# EasyEDA Pro project ProProject_TC264主板_2024-10-06.epro

# Schematic Schematic1

## Sheets
1 CoreBoard
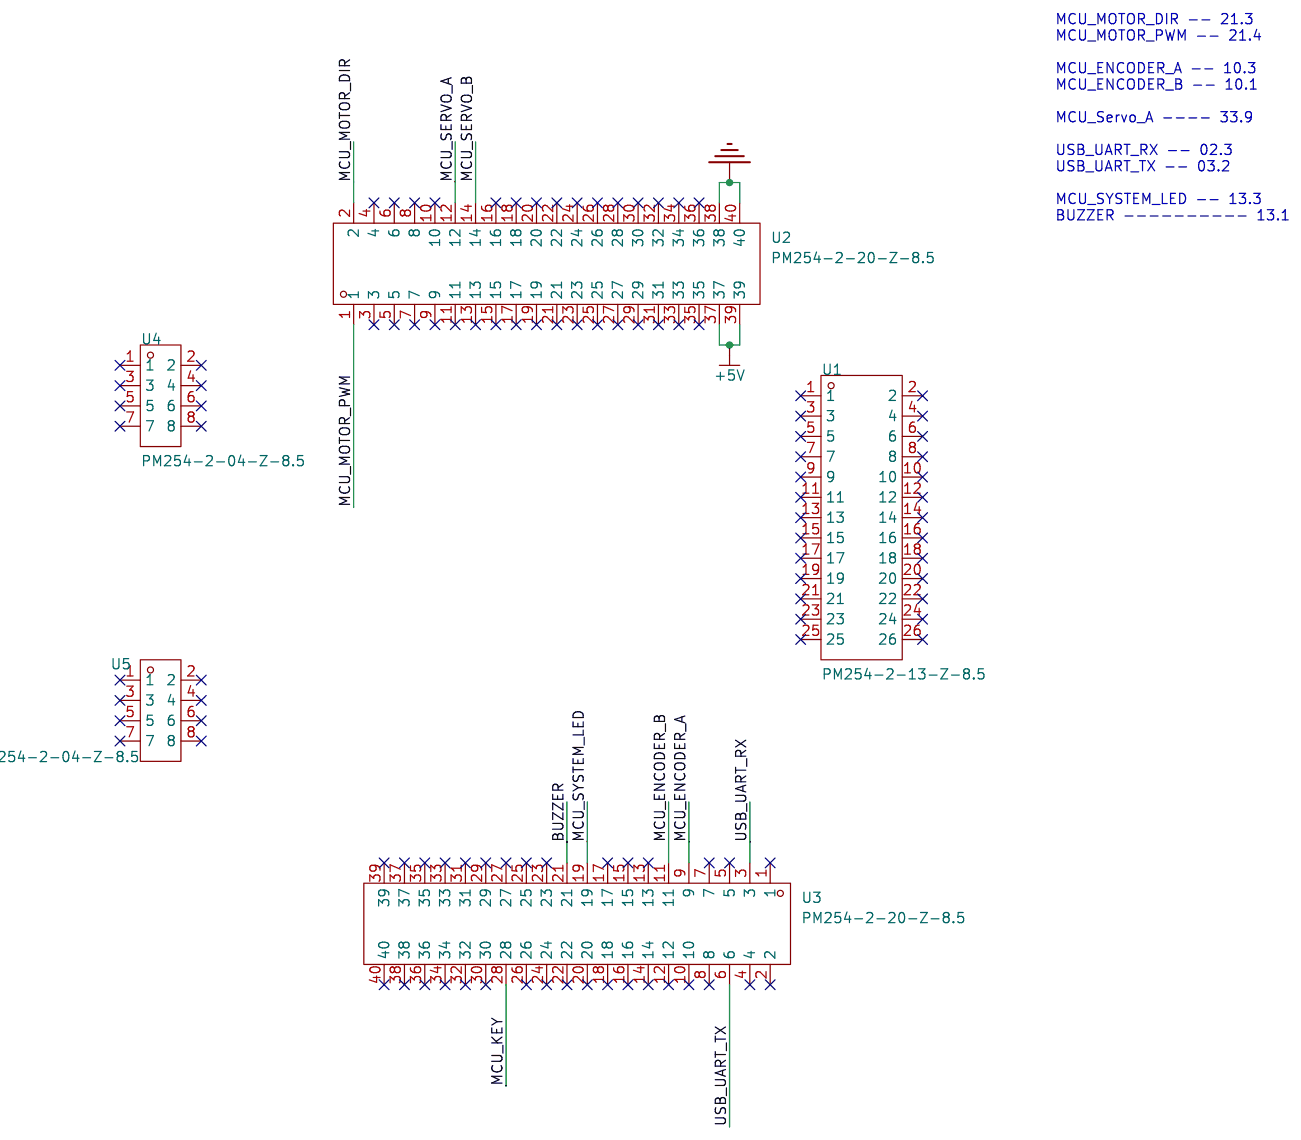
[diagram p0: CoreBoard]
2 Power: Create Date: 2024-03-05; Page Name: Power; Project Name: TC264主板; Schematic Name: Schematic1; Update Date: 2024-03-05; Company: 嘉立创EDA; Page Size: A4; Version: V1.0
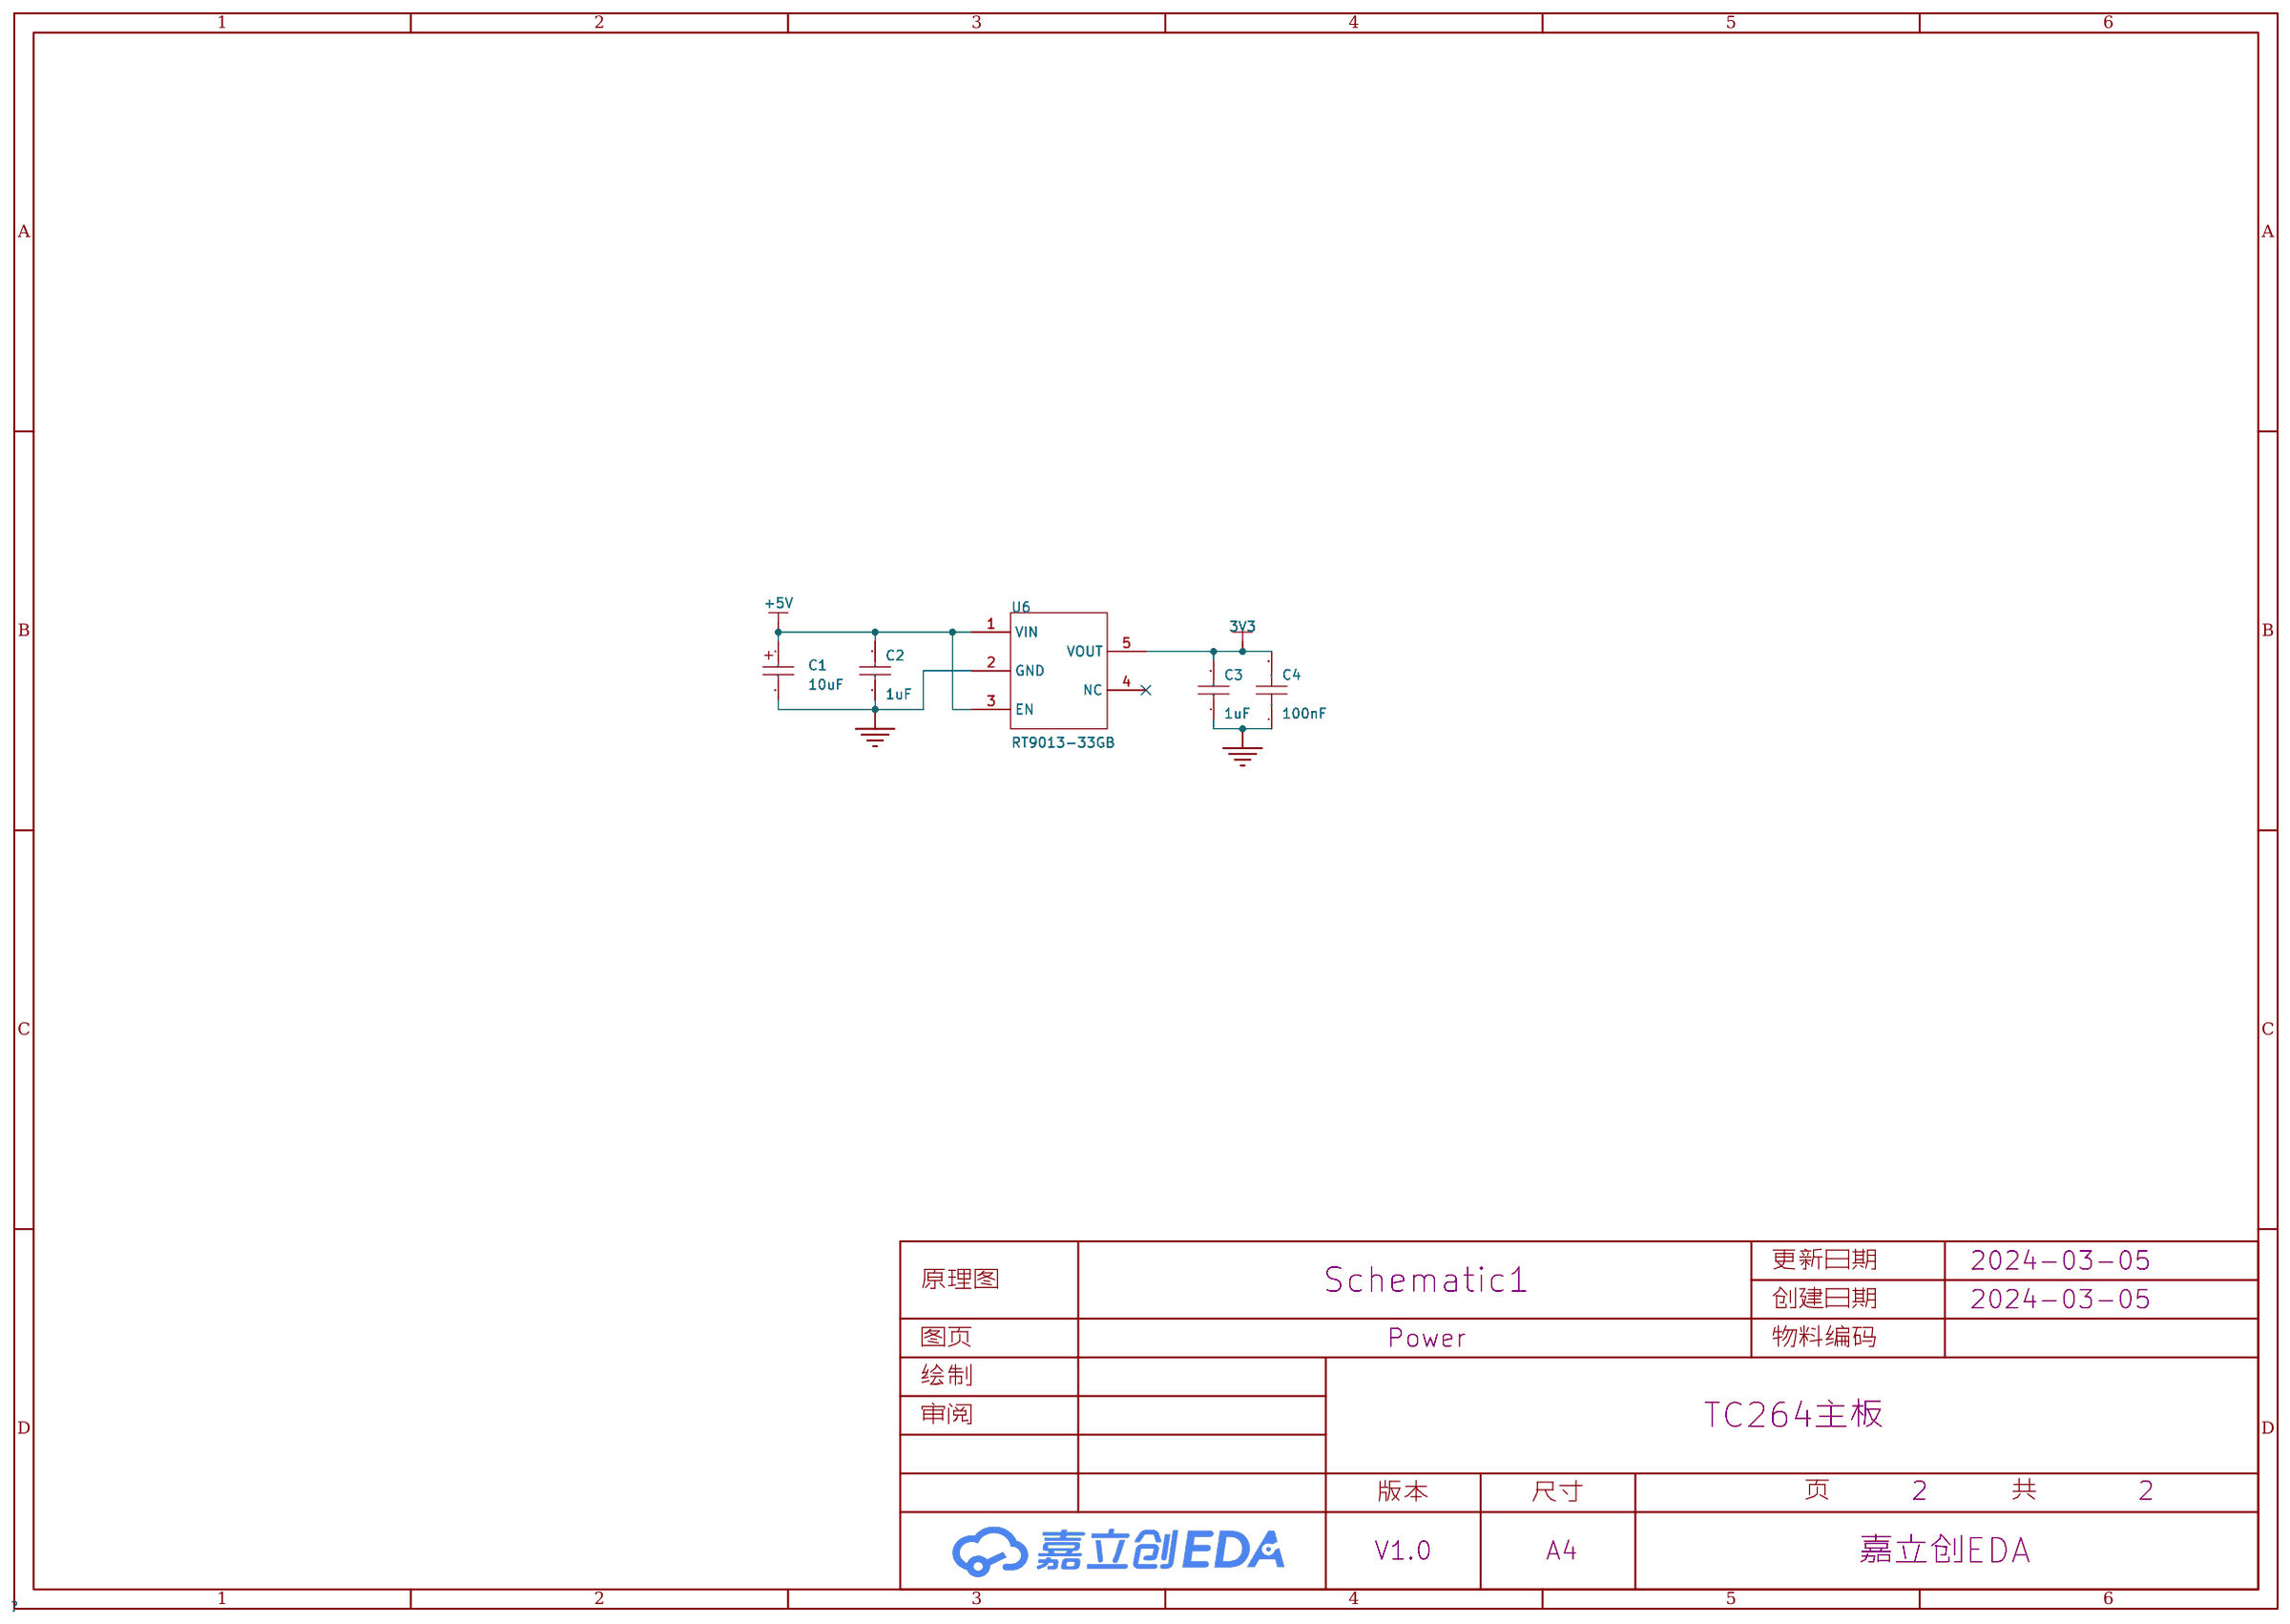
[diagram p1: Power]
3 HMI: Create Date: 2024-03-05; Page Name: HMI; Project Name: TC264主板; Schematic Name: Schematic1; Update Date: 2024-03-07; Company: 嘉立创EDA; Page Size: A4; Version: V1.0
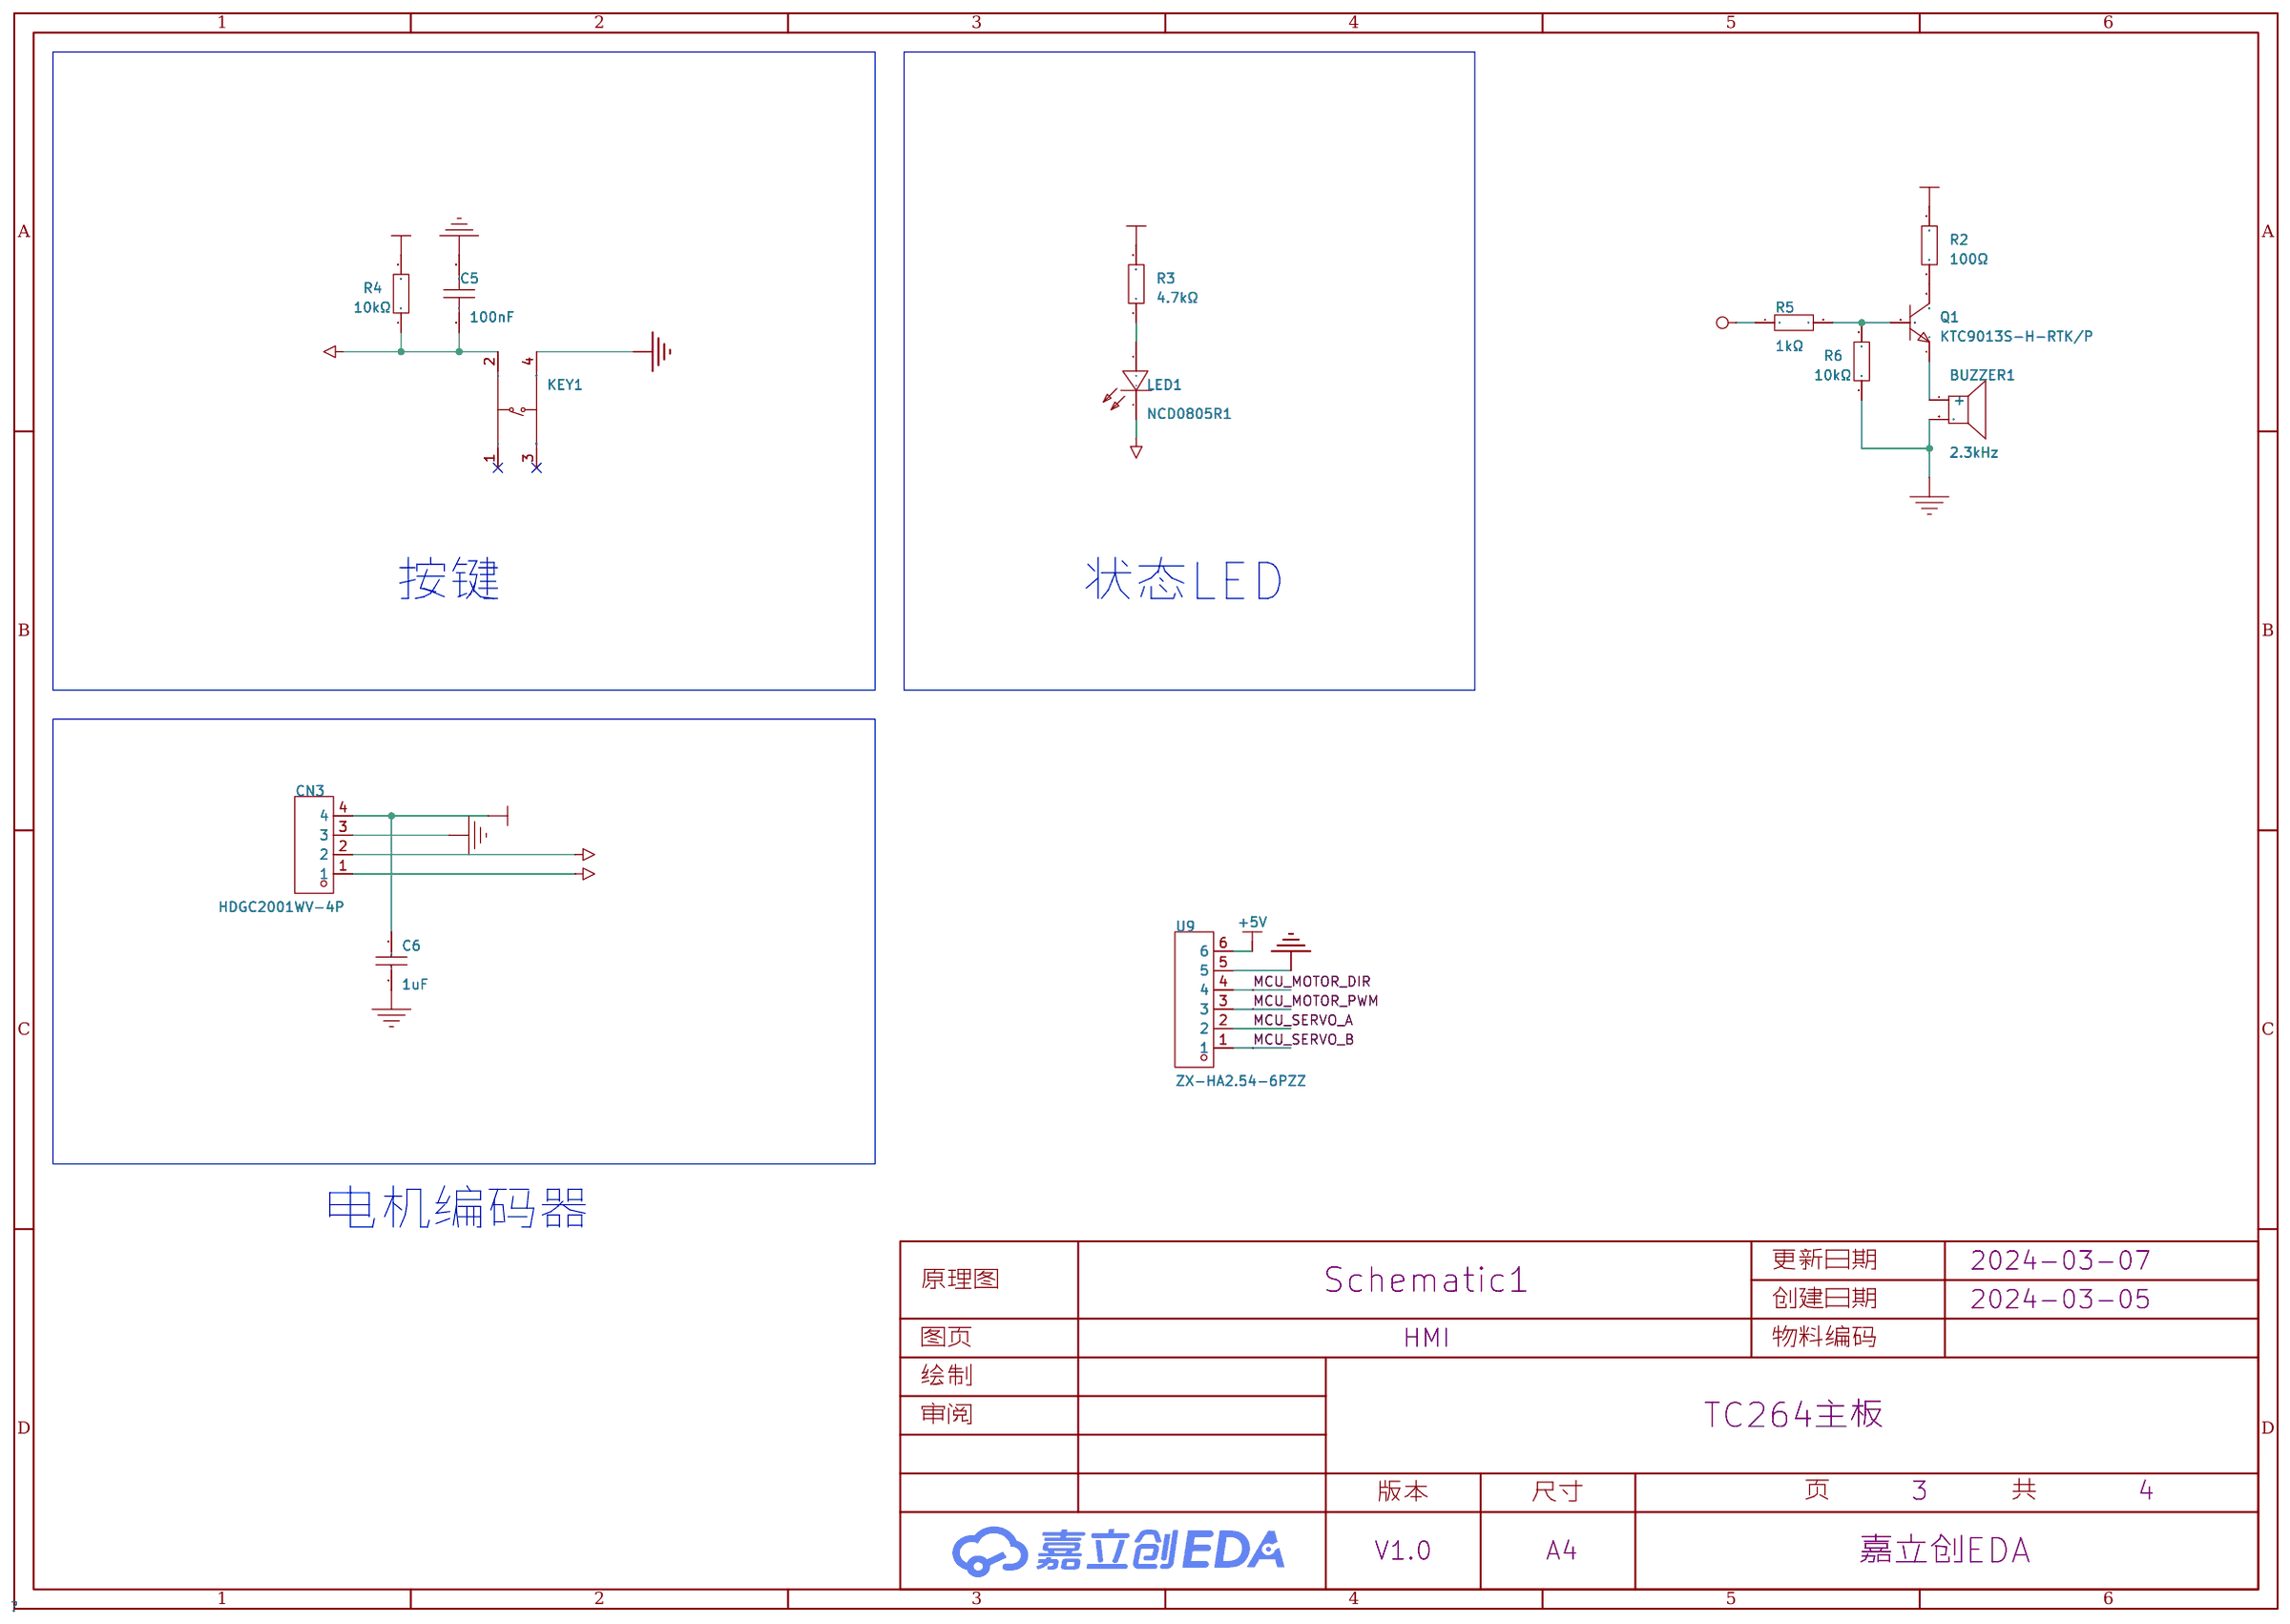
[diagram p2: HMI]
4 COM: Create Date: 2024-03-05; Page Name: COM; Project Name: TC264主板; Schematic Name: Schematic1; Update Date: 2024-05-22; Company: 嘉立创EDA; Page Size: A4; Version: V1.0
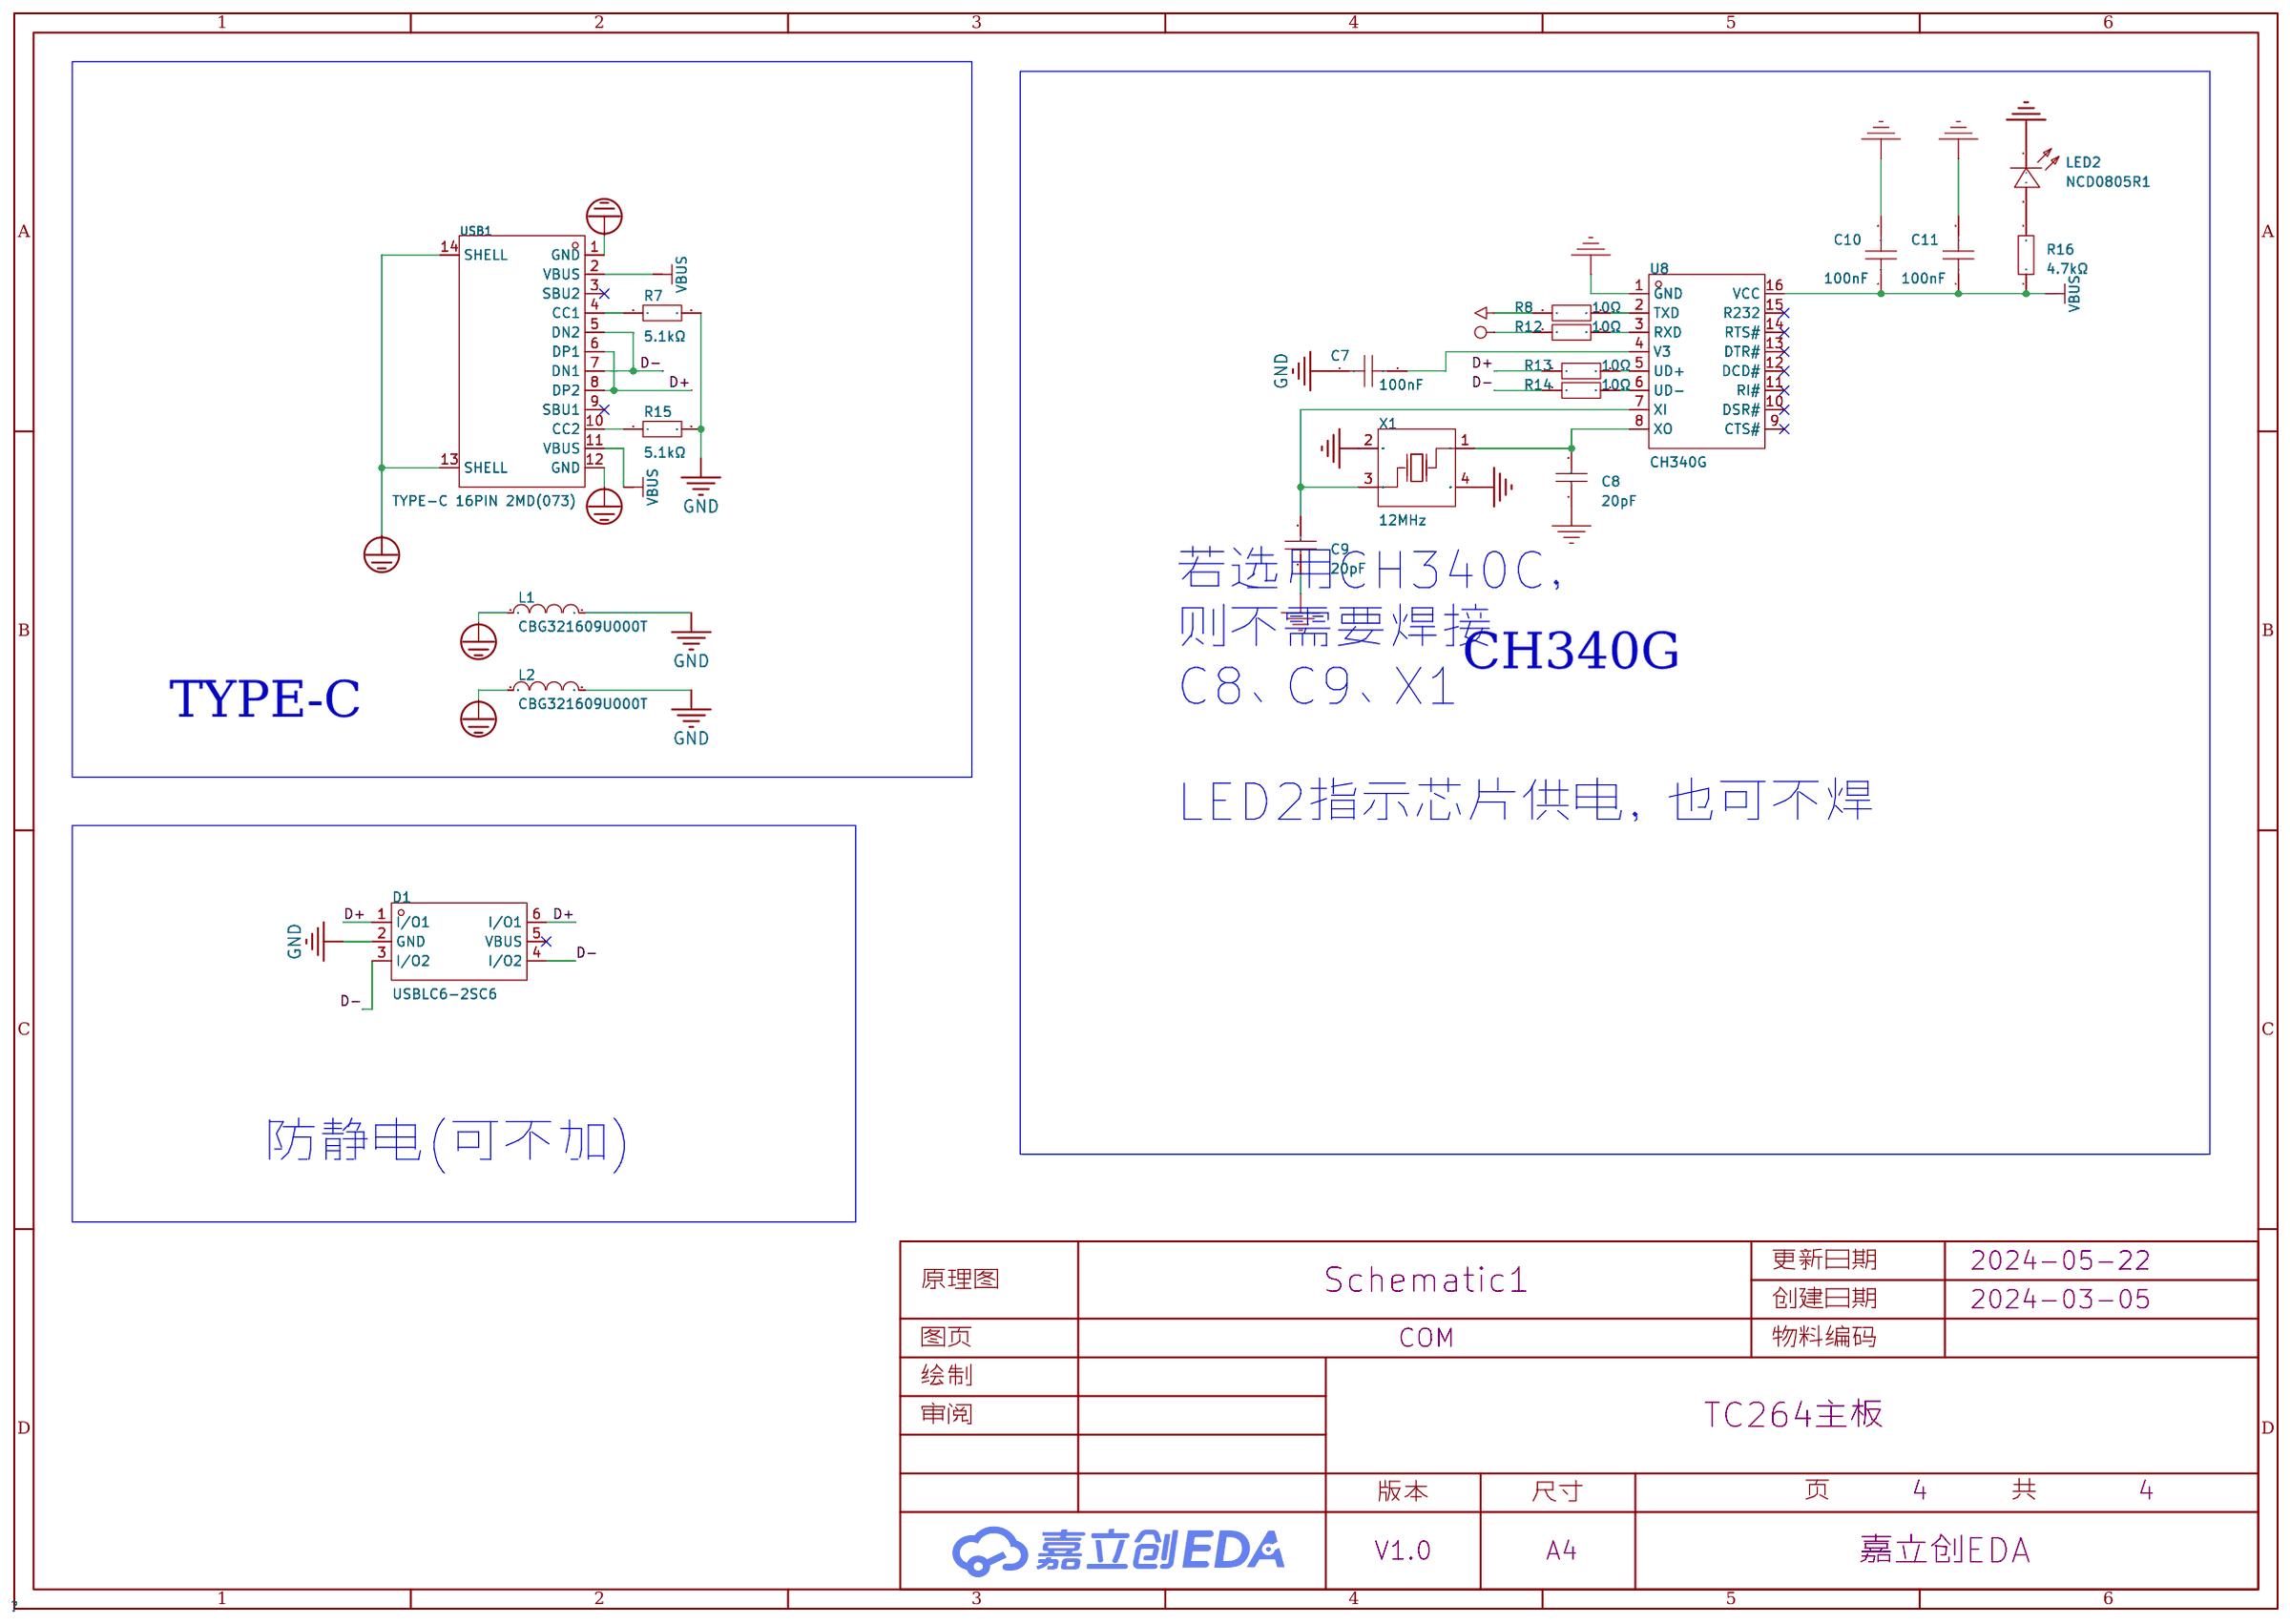
[diagram p3: COM]

## Parts
sheet COM
C7  100nF  [C0603]
C8  20pF  [C0603]
C9  20pF  [C0603]
C10  100nF  [C0603]
C11  100nF  [C0603]
D1  USBLC6-2SC6  [SOT-23-6_L2.9-W1.6-P0.95-LS2.8-BL]
L1  CBG321609U000T  [L1206]
L2  CBG321609U000T  [L1206]
LED2  NCD0805R1  [LED0805-RD]
R7  5.1kΩ  [R0603]
R8  10Ω  [R0603]
R12  10Ω  [R0603]
R13  10Ω  [R0603]
R14  10Ω  [R0603]
R15  5.1kΩ  [R0603]
R16  4.7kΩ  [R0805]
U8  CH340G  [SOIC-16_L9.9-W3.9-P1.27-LS6.0-BL]
USB1  TYPE-C 16PIN 2MD(073)  [USB-C-SMD_TYPE-C-6PIN-2MD-073]
X1  12MHz  [OSC-SMD_4P-L3.2-W2.5-BL]
sheet CoreBoard
U1  PM254-2-13-Z-8.5  [HDR-TH_26P-P2.54-V-F-R2-C13-S2.54-1]
U2  PM254-2-20-Z-8.5  [HDR-TH_40P-P2.54-V-F-R2-C20-S2.54]
U3  PM254-2-20-Z-8.5  [HDR-TH_40P-P2.54-V-F-R2-C20-S2.54]
U4  PM254-2-04-Z-8.5  [HDR-TH_8P-P2.54-V-F-R2-C4-S2.54]
U5  PM254-2-04-Z-8.5  [HDR-TH_8P-P2.54-V-F-R2-C4-S2.54]
sheet HMI
BUZZER1  2.3kHz  [BUZ-TH_BD12.0-P7.60-D0.6-FD]
C5  100nF  [C0603]
C6  1uF  [C0603]
CN3  HDGC2001WV-4P  [CONN-TH_4P-P2.00_HDGC_HDGC2001WV-4P]
KEY1  TS665CJ  [SW-TH_4P-L6.0-W6.0-P4.50-LS6.5]
LED1  NCD0805R1  [LED0805-RD]
Q1  KTC9013S-H-RTK/P  [SOT-23-3_L2.9-W1.3-P1.90-LS2.4-TR-CW]
R2  100Ω  [R0603]
R3  4.7kΩ  [R0805]
R4  10kΩ  [R0603]
R5  1kΩ  [R0603]
R6  10kΩ  [R0603]
U9  ZX-HA2.54-6PZZ  [CONN-TH_6P-P2.50_ZX-HA2.54-6PZZ]
sheet Power
C1  10uF  [CAP-SMD_L3.2-W1.6-RD-C7171]
C2  1uF  [C0603]
C3  1uF  [C0603]
C4  100nF  [C0603]
U6  RT9013-33GB  [SOT-23-5_L3.0-W1.7-P0.95-LS2.8-BL]

## Library data of the parts
C4 C5 C7 C10 C11 = CC0603KRX7R9BB104: 容值:100nF;精度:±10%;额定电压:50V;材质(温度系数):X7R;; LCSC Part Name: 100nF ±10% 50V; Supplier Part: C14663; Manufacturer: YAGEO(国巨); Supplier Footprint: 0603; JLCPCB Part Class: 基础库; Datasheet: https://atta.szlcsc.com/upload/public/pdf/source/20180910/C282072_33301C7F631E79921B82A8DAC6BCC5B3.pdf; Supplier: LCSC; Tolerance: ±10%; Voltage Rated: 50V; Temperature Coefficient: X7R
C8 C9 = CC0603JRNPO9BN200: 容值:20pF;精度:±5%;额定电压:50V;材质(温度系数):NP0;; LCSC Part Name: 20pF ±5% 50V; Supplier Part: C105621; Manufacturer: YAGEO(国巨); Supplier Footprint: 0603; JLCPCB Part Class: Extended Part; Datasheet: https://atta.szlcsc.com/upload/public/pdf/source/20170425/1493115771885.pdf; Supplier: LCSC; Tolerance: ±5%; Voltage Rated: 50V; Temperature Coefficient: NP0
D1 = USBLC6-2SC6: Supplier Part: C2687116; Manufacturer: UMW(广东友台半导体); Supplier Footprint: SOT-23-6; Datasheet: https://atta.szlcsc.com/upload/public/pdf/source/20220623/8F66CD7F92B22A875BD04E197BDA4F88.pdf; Supplier: LCSC
L1 L2 = CBG321609U000T: 标称阻抗@测试频率:0Ω@100MHz;直流电阻(RDC):100mΩ;; LCSC Part Name: 单路 1206磁珠 阻抗0Ω@100MHz; Supplier Part: C94305; Manufacturer: FH(风华); Supplier Footprint: 1206; JLCPCB Part Class: 扩展库; Datasheet: https://atta.szlcsc.com/upload/public/pdf/source/20170914/C94305_1505374147416969225.pdf; Supplier: LCSC; Impedance @ Frequency: 0Ω@100MHz; DC Resistance: 100mΩ; Current Rating: 1A; Circuits: 1
LED1 LED2 = NCD0805R1: 发光颜色:红灯;; LCSC Part Name: 红灯; Supplier Part: C84256; Manufacturer: 国星光电; Supplier Footprint: 0805; JLCPCB Part Class: Basic Part; Datasheet: https://atta.szlcsc.com/upload/public/pdf/source/20200820/C84256_F0A75A43B3EAD75808600A0514C76B99.pdf; Supplier: LCSC; Emitted Color: 红灯
R7 R15 = 0603WAF5101T5E: 电阻类型:厚膜电阻;阻值:5.1kΩ;精度:±1%;功率:100mW;温度系数:±100ppm/℃;最大工作电压:75V;工作温度范围:-55℃~+155℃;; LCSC Part Name: 5.1kΩ ±1% 100mW; Supplier Part: C23186; Manufacturer: UNI-ROYAL(厚声); Supplier Footprint: 0603; JLCPCB Part Class: 基础库; Datasheet: https://atta.szlcsc.com/upload/public/pdf/source/20200306/C422600_1E6D84923E4A46A82E41ADD87F860B5C.pdf; Supplier: LCSC; Type: 厚膜电阻; Tolerance: ±1%; Power(Watts): 100mW; Temperature Coefficient: ±100ppm/℃; Overload Voltage (Max): 75V; Operating Temperature Range: -55℃~+155℃
R8 R12-R14 = 0603WAF100JT5E: 电阻类型:厚膜电阻;阻值:10Ω;精度:±1%;功率:100mW;温度系数:±400ppm/℃;最大工作电压:75V;工作温度范围:-55℃~+155℃;; LCSC Part Name: 10Ω ±1% 100mW; Supplier Part: C22859; Manufacturer: UNI-ROYAL(厚声); Supplier Footprint: 0603; JLCPCB Part Class: 基础库; Datasheet: https://atta.szlcsc.com/upload/public/pdf/source/20200306/C422600_1E6D84923E4A46A82E41ADD87F860B5C.pdf; Supplier: LCSC; Type: 厚膜电阻; Tolerance: ±1%; Power(Watts): 100mW; Temperature Coefficient: ±400ppm/℃; Overload Voltage (Max): 75V; Operating Temperature Range: -55℃~+155℃
R3 R16 = RS-05K4701FT: 阻值:4.7kΩ;精度:±1%;功率:125mW;温度系数:±100ppm/℃;最大工作电压:150V;工作温度范围:-55℃~+155℃;; LCSC Part Name: 4.7kΩ ±1% 125mW; Supplier Part: C115319; Manufacturer: FH(风华); Supplier Footprint: 0805; JLCPCB Part Class: Extended Part; Datasheet: https://atta.szlcsc.com/upload/public/pdf/source/20170912/C115319_1505207841791963513.pdf; Supplier: LCSC; Tolerance: ±1%; Power(Watts): 125mW; Temperature Coefficient: ±100ppm/℃; Overload Voltage (Max): 150V; Operating Temperature Range: -55℃~+155℃
U8 = CH340G: 类型:Transceiver;协议类别:USB 2.0;驱动器/接收器数:-;数据速率:2Mbps;; Supplier Part: C14267; Manufacturer: WCH(南京沁恒); Supplier Footprint: SOP-16-150mil; JLCPCB Part Class: Extended Part; Datasheet: https://atta.szlcsc.com/upload/public/pdf/source/20200819/C14267_9F0B4B8160AEBA86F3219E64956E4601.pdf; Supplier: LCSC; Type: Transceiver; Protocol: USB 2.0; Data Rate: 2Mbps; Supply Voltage: 3.3V, 5V
USB1 = TYPE-C 16PIN 2MD(073): 连接器类型:Type-C;标准:-;公母:母座;触点数量:16;端口数量:1;安装方式:卧贴;额定电流 - 电源:5A;工作温度范围:-25℃~+85℃;; LCSC Part Name: TYPE-C母座 16P 4脚插件带定位柱 不锈钢外壳 2次模顶; Supplier Part: C2765186; Manufacturer: SHOU HAN(首韩); Supplier Footprint: SMD; Supplier: LCSC; Connector Type: Type-C; Gender: 母座; Number of Contacts: 16; Number of Ports: 1; Mounting Style: 卧贴; Current Rating - Power (Max): 5A; Operating Temperature Range: -25℃~+85℃
X1 = X322512MSB4SI: 晶振类型:贴片无源晶振;频率:12MHz;频率公差:±10ppm;频率稳定度:±30ppm;负载电容:20pF;工作温度:-40℃~+85℃;; LCSC Part Name: 12MHz ±10ppm 20pF; Supplier Part: C9002; Manufacturer: YXC(扬兴晶振); Supplier Footprint: SMD3225-4P; JLCPCB Part Class: Basic Part; Datasheet: https://atta.szlcsc.com/upload/public/pdf/source/20210329/C112971_1F611BDC486E193C1706F6D8EB5AA189.pdf; Supplier: LCSC; Crystal Type: 贴片无源晶振; Frequency Tolerance: ±10ppm; Frequency Stability: ±30ppm; Load Capacitance: 20pF; Operating Temperature: -40℃~+85℃
U1 = PM254-2-13-Z-8.5: 插孔结构:2x13P;间距:2.54mm;行距:2.54mm;圆孔/方孔:方孔;安装类型:直插;排数:双排;总孔位数:26P;额定电流:3A;额定电压:-;插孔方向:顶部;塑高:8.5mm;触头材质:铜合金;工作温度范围:-40℃~+105℃;焊接温度(最大值):260℃@5S;; LCSC Part Name: 2x13P 间距:2.54mm 直插; Supplier Part: C2897414; Manufacturer: HCTL(华灿天禄); Supplier Footprint: 插件,P=2.54mm; JLCPCB Part Class: 扩展库; Datasheet: https://atta.szlcsc.com/upload/public/pdf/source/20230609/3D36CA2C1BFC9FD1C3F709AD9DFEB9C2.pdf; Supplier: LCSC; Holes Structure: 2x13P; Pitch: 2.54mm; Row Spacing: 2.54mm; Circular Hole / Square Hole: 方孔; Mounting Type: 直插; Number of Rows: 双排; Number of Holes: 26P; Current Rating (Max): 3A; Holes Direction: 顶部; Insulation Height: 8.5mm; Contact Material: 铜合金; Operating Temperature Range: -40℃~+105℃; Soldering Temperature(Max): 260℃@5S
U2 U3 = PM254-2-20-Z-8.5: 插孔结构:2x20P;间距:2.54mm;行距:2.54mm;圆孔/方孔:方孔;安装类型:直插;排数:双排;总孔位数:40P;额定电流:3A;额定电压:-;插孔方向:顶部;塑高:8.5mm;触头材质:铜合金;工作温度范围:-40℃~+105℃;焊接温度(最大值):260℃@5S;; LCSC Part Name: 2x20P 间距:2.54mm 直插; Supplier Part: C2897421; Manufacturer: HCTL(华灿天禄); Supplier Footprint: 插件,P=2.54mm; JLCPCB Part Class: 扩展库; Datasheet: https://atta.szlcsc.com/upload/public/pdf/source/20230609/3D36CA2C1BFC9FD1C3F709AD9DFEB9C2.pdf; Supplier: LCSC; Holes Structure: 2x20P; Pitch: 2.54mm; Row Spacing: 2.54mm; Circular Hole / Square Hole: 方孔; Mounting Type: 直插; Number of Rows: 双排; Number of Holes: 40P; Current Rating (Max): 3A; Holes Direction: 顶部; Insulation Height: 8.5mm; Contact Material: 铜合金; Operating Temperature Range: -40℃~+105℃; Soldering Temperature(Max): 260℃@5S
U4 U5 = PM254-2-04-Z-8.5: 插孔结构:2x4P;间距:2.54mm;行距:2.54mm;圆孔/方孔:方孔;安装类型:直插;排数:双排;总孔位数:8P;额定电流:3A;额定电压:-;插孔方向:顶部;塑高:8.5mm;触头材质:铜合金;工作温度范围:-40℃~+105℃;焊接温度(最大值):260℃@5S;; LCSC Part Name: 2x4P 间距:2.54mm 直插; Supplier Part: C2897405; Manufacturer: HCTL(华灿天禄); Supplier Footprint: 插件,P=2.54mm; JLCPCB Part Class: 扩展库; Datasheet: https://atta.szlcsc.com/upload/public/pdf/source/20230609/3D36CA2C1BFC9FD1C3F709AD9DFEB9C2.pdf; Supplier: LCSC; Holes Structure: 2x4P; Pitch: 2.54mm; Row Spacing: 2.54mm; Circular Hole / Square Hole: 方孔; Mounting Type: 直插; Number of Rows: 双排; Number of Holes: 8P; Current Rating (Max): 3A; Holes Direction: 顶部; Insulation Height: 8.5mm; Contact Material: 铜合金; Operating Temperature Range: -40℃~+105℃; Soldering Temperature(Max): 260℃@5S
BUZZER1 = TMB12A05_C96093: 驱动方式:有源(内含驱动线路);构造类型:电磁式;额定电压:5V;频率:2.3kHz;声压(SPL):85dB@5V,10cm;; LCSC Part Name: TMB12A05; Supplier Part: C96093; Manufacturer: 华能; Manufacturer Part: TMB12A05; Supplier Footprint: 插件,D=12mm; JLCPCB Part Class: Extended Part; Datasheet: https://atta.szlcsc.com/upload/public/pdf/source/20170522/1495448324811.pdf; Supplier: LCSC; Oscillator Circuit: 有源(内含驱动线路); Technology Type: 电磁式; Rated Voltage: 5V; Operating Voltage: 4V~8V; Sound Pressure Level (SPL): 85dB@5V,10cm; Diameter (φD): 12mm; Height: 9.8mm
C6 = 0603B105K250NT: 容值:1uF;精度:±10%;额定电压:25V;材质(温度系数):X7R;; LCSC Part Name: 1uF ±10% 25V; Supplier Part: C59302; Manufacturer: FH(风华); Supplier Footprint: 0603; JLCPCB Part Class: Extended Part; Datasheet: https://atta.szlcsc.com/upload/public/pdf/source/20170923/C59302_1506149498957988854.pdf; Supplier: LCSC; Tolerance: ±10%; Voltage Rated: 25V; Temperature Coefficient: X7R
CN3 = HDGC2001WV-4P: LCSC Part Name: PH2.0直针 4P; Supplier Part: C5175232; Manufacturer: HDGC(华德共创); Supplier Footprint: 直插,P=2mm; JLCPCB Part Class: Extended Part; Datasheet: https://atta.szlcsc.com/upload/public/pdf/source/20220916/C6875813FFA1039A4B3E585D63AEFA0D.pdf; Supplier: LCSC
KEY1 = TS665CJ: 触点电流:50mA;额定电压(DC):12V;电路结构:单刀单掷;安装方式:直插;按钮形状:圆形按钮;带灯:-;开关长度:6mm;开关宽度:6mm;开关高度:5mm;; LCSC Part Name: 6*6*5插件立式直插6x6dip按键轻触开关; Supplier Part: C393938; Manufacturer: SHOU HAN(首韩); Supplier Footprint: 插件; JLCPCB Part Class: 扩展库; Datasheet: https://atta.szlcsc.com/upload/public/pdf/source/20190521/C393938_BDABEAC600B4C55E200A80AA129B70BC.pdf; Supplier: LCSC; Contact Current: 50mA; Voltage Rating (DC): 12V; Circuit: 单刀单掷; Mounting Style: 直插; Actuator Style: 圆形按钮; Switch Length: 6mm; Switch Width: 6mm; Switch Height: 5mm
Q1 = KTC9013S-H-RTK/P: 晶体管类型:NPN;集射极击穿电压(Vceo):30V;集电极电流(Ic):500mA;功率(Pd):350mW;集电极截止电流(Icbo):100nA;集电极-发射极饱和电压(VCE(sat)@Ic,Ib):100mV@100mA,10mA;直流电流增益(hFE@Ic,Vce):96@50mA,1V;特征频率(fT):140MHz;工作温度:+150℃@(Tj);; LCSC Part Name: NPN 30V 500mA; Supplier Part: C125310; Manufacturer: KEC; Supplier Footprint: SOT-23; JLCPCB Part Class: Extended Part; Datasheet: https://atta.szlcsc.com/upload/public/pdf/source/20171201/C125310_15121174280461155976.pdf; Supplier: LCSC; Transistor Type: NPN; Collector-Emitter Breakdown Voltage (Vceo): 30V; Collector Current (Ic): 500mA; Power Dissipation (Pd): 350mW; Collector Cut-Off Current (Icbo): 100nA; Collector-Emitter Saturation Voltage (VCE(sat)@Ic,Ib): 100mV@100mA,10mA; DC Current Gain (hFE@Ic,Vce): 96@50mA,1V; Transition Frequency (fT): 140MHz; Operating Temperature: +150℃@(Tj)
R2 = 0603WAF1000T5E: 电阻类型:厚膜电阻;阻值:100Ω;精度:±1%;功率:100mW;温度系数:±200ppm/℃;最大工作电压:75V;工作温度范围:-55℃~+155℃;; LCSC Part Name: 100Ω ±1% 100mW; Supplier Part: C22775; Manufacturer: UNI-ROYAL(厚声); Supplier Footprint: 0603; JLCPCB Part Class: Basic Part; Datasheet: https://atta.szlcsc.com/upload/public/pdf/source/20200306/C422600_1E6D84923E4A46A82E41ADD87F860B5C.pdf; Supplier: LCSC; Type: 厚膜电阻; Tolerance: ±1%; Power(Watts): 100mW; Temperature Coefficient: ±200ppm/℃; Overload Voltage (Max): 75V; Operating Temperature Range: -55℃~+155℃
R4 R6 = 0603WAF1002T5E: 电阻类型:厚膜电阻;阻值:10kΩ;精度:±1%;功率:100mW;温度系数:±100ppm/℃;最大工作电压:75V;工作温度范围:-55℃~+155℃;; LCSC Part Name: 10kΩ ±1% 100mW; Supplier Part: C25804; Manufacturer: UNI-ROYAL(厚声); Supplier Footprint: 0603; JLCPCB Part Class: Basic Part; Datasheet: https://atta.szlcsc.com/upload/public/pdf/source/20200306/C422600_1E6D84923E4A46A82E41ADD87F860B5C.pdf; Supplier: LCSC; Type: 厚膜电阻; Tolerance: ±1%; Power(Watts): 100mW; Temperature Coefficient: ±100ppm/℃; Overload Voltage (Max): 75V; Operating Temperature Range: -55℃~+155℃
R5 = 0603WAF1001T5E: 电阻类型:厚膜电阻;阻值:1kΩ;精度:±1%;功率:100mW;温度系数:±100ppm/℃;最大工作电压:75V;工作温度范围:-55℃~+155℃;; LCSC Part Name: 1kΩ ±1% 100mW; Supplier Part: C21190; Manufacturer: UNI-ROYAL(厚声); Supplier Footprint: 0603; JLCPCB Part Class: Basic Part; Datasheet: https://atta.szlcsc.com/upload/public/pdf/source/20200306/C422600_1E6D84923E4A46A82E41ADD87F860B5C.pdf; Supplier: LCSC; Type: 厚膜电阻; Tolerance: ±1%; Power(Watts): 100mW; Temperature Coefficient: ±100ppm/℃; Overload Voltage (Max): 75V; Operating Temperature Range: -55℃~+155℃
U9 = ZX-HA2.54-6PZZ: 插针结构:1x6P;间距:2.54mm;安装方式:直插;参考系列:XH;总PIN数:6P;排数:1;每排PIN数:6;行距:-;额定电流:3A;触头材质:黄铜;触头镀层:锡;工作温度范围:-25℃~+85℃;; LCSC Part Name: 1x6P 间距:2.54mm 直插 系列:XH/HA带扣; Supplier Part: C7429618; Manufacturer: Megastar(兆星); Supplier Footprint: 插件,P=2.54mm; JLCPCB Part Class: 扩展库; Datasheet: https://atta.szlcsc.com/upload/public/pdf/source/20230619/9741958357BE16A00186B372434A49B2.pdf; Supplier: LCSC; Pins Structure: 1x6P; Pitch: 2.54mm; Mounting Style: 直插; Reference Series: XH; Number of Pins: 6P; Number of Rows: 1; Number of PINs Per Row: 6; Current Rating (Max): 3A; Contact Material: 黄铜; Contact Plating: 锡; Operating Temperature Range: -25℃~+85℃
C1 = TAJA106K016RNJ: 容值:10uF;精度:±10%;额定电压:16V;等效串联电阻:3Ω@100kHz;; LCSC Part Name: 10uF ±10% 16V; Supplier Part: C7171; Manufacturer: Kyocera AVX; Supplier Footprint: CASE-A-3216; JLCPCB Part Class: 基础库; Datasheet: https://atta.szlcsc.com/upload/public/pdf/source/20160107/1457707750344.pdf; Supplier: LCSC; Tolerance: ±10%; Rated Voltage: 16V; Equivalent Series Resistance(ESR): 3Ω@100kHz; Operating Temperature: -55℃~+125℃
C2 C3 = 0603B105K250NT: 容值:1uF;精度:±10%;额定电压:25V;材质(温度系数):X7R;; LCSC Part Name: 1uF ±10% 25V; Supplier Part: C59302; Manufacturer: FH(风华); Supplier Footprint: 0603; JLCPCB Part Class: 扩展库; Datasheet: https://atta.szlcsc.com/upload/public/pdf/source/20200305/C486355_26A10D38EF8C2A5C37091D0039909270.pdf; Supplier: LCSC; Tolerance: ±10%; Voltage Rated: 25V; Temperature Coefficient: X7R
U6 = RT9013-33GB: 输出类型:固定;最大输入电压:5.5V;输出电压:3.3V;最大输出电流:500mA;电源纹波抑制比(PSRR):50dB@(10kHz);输出极性:正极;; LCSC Part Name: 输入5.5V 输出3.3V 500mA; Supplier Part: C47773; Manufacturer: RICHTEK(立锜); Supplier Footprint: SOT-23-5; JLCPCB Part Class: 扩展库; Datasheet: https://atta.szlcsc.com/upload/public/pdf/source/20150504/1457707282459.pdf; Supplier: LCSC; Output Type: 固定; Maximum Input Voltage: 5.5V; Output Voltage: 3.3V; MAX Output Current: 500mA; Power Supply Rejection Ratio (PSRR): 50dB@(10kHz); Dropout Voltage: 400mV@(500mA); standby current: 50uA; Operating Temperature: -40℃~+85℃; Output Polarity: 正极; Number of Outputs: 1

## Nets
3V3: C3.2 C4.2 R3.2 R4.2 U6.5(VOUT)
+5V: C1.1 C2.2 C6.2 CN3.4 R2.2 U2.37 U2.39 U6.1(VIN) U6.3(EN) U9.6
GND: BUZZER1.2 C1.2 C2.1 C3.1 C4.1 C5.2 C6.1 C7.1 C8.1 C9.1 C10.2 C11.2 CN3.3 D1.2(GND) KEY1.4(D) L1.2 L2.2 LED2.1(-) R6.1 R7.2 R15.2 U2.38 U2.40 U6.2(GND) U8.1(GND) U9.5 X1.2(GND) X1.4(GND)
PGND: L1.1 L2.1 USB1.1(GND) USB1.12(GND) USB1.13(SHELL) USB1.14(SHELL)
VBUS: C10.1 C11.1 R16.1 U8.16(VCC) USB1.2(VBUS) USB1.11(VBUS)
BUZZER: R5.1 U3.21
D+: D1.1(I/O1) D1.6(I/O1) R13.1 USB1.6(DP1) USB1.8(DP2)
D-: D1.3(I/O2) D1.4(I/O2) R14.1 USB1.5(DN2) USB1.7(DN1)
MCU_ENCODER_A: CN3.2 U3.9
MCU_ENCODER_B: CN3.1 U3.11
MCU_KEY: C5.1 KEY1.2(B) R4.1 U3.28
MCU_MOTOR_DIR: U2.2 U9.4
MCU_MOTOR_PWM: U2.1 U9.3
MCU_SERVO_A: U2.12 U9.2
MCU_SERVO_B: U2.14 U9.1
MCU_SYSTEM_LED: LED1.1(-) U3.19
USB_UART_RX: R8.1 U3.3
USB_UART_TX: R12.1 U3.6
$3N545: Q1.2(B) R5.2 R6.2
$3N546: BUZZER1.1(+) Q1.1(E)
$3N549: Q1.3(C) R2.1
$3N998: LED1.2(+) R3.1
$4N891: C8.2 U8.8(XO) X1.1(OSC1)
$4N894: R8.2 U8.2(TXD)
$4N895: R12.2 U8.3(RXD)
$4N896: R13.2 U8.5(UD+)
$4N897: R14.2 U8.6(UD-)
$4N898: C9.2 U8.7(XI) X1.3(OSC2)
$4N903: C7.2 U8.4(V3)
$4N910: R7.1 USB1.4(CC1)
$4N911: R15.1 USB1.10(CC2)
$4N1948: LED2.2(+) R16.2

Not connected (* = marked no-connect by the designer): D1 5(VBUS)*; KEY1 1(A)* 3(C)*; U1 1* 2* 3* 4* 5* 6* 7* 8* 9* 10* 11* 12* 13* 14* 15* 16* 17* 18* 19* 20* 21* 22* 23* 24* 25* 26*; U2 3* 4* 5* 6* 7* 8* 9* 10* 11* 13* 15* 16* 17* 18* 19* 20* 21* 22* 23* 24* 25* 26* 27* 28* 29* 30* 31* 32* 33* 34* 35* 36*; U3 1* 2* 4* 5* 7* 8* 10* 12* 13* 14* 15* 16* 17* 18* 20* 22* 23* 24* 25* 26* 27* 29* 30* 31* 32* 33* 34* 35* 36* 37* 38* 39* 40*; U4 1* 2* 3* 4* 5* 6* 7* 8*; U5 1* 2* 3* 4* 5* 6* 7* 8*; U6 4(NC)*; U8 9(CTS#)* 10(DSR#)* 11(RI#)* 12(DCD#)* 13(DTR#)* 14(RTS#)* 15(R232)*; USB1 3(SBU2)* 9(SBU1)*

## Notes on the sheets
sheet 1
- MCU_MOTOR_DIR -- 21.3
  MCU_MOTOR_PWM -- 21.4
  MCU_ENCODER_A -- 10.3
  MCU_ENCODER_B -- 10.1
  MCU_Servo_A ---- 33.9
  USB_UART_RX -- 02.3
  USB_UART_TX -- 03.2
  MCU_SYSTEM_LED -- 13.3
  BUZZER ---------- 13.1
sheet 3
- 按键
- 状态LED
- 电机编码器
sheet 4
- CH340G
- TYPE-C
- 若选用CH340C，
  则不需要焊接
  C8、C9、X1
  LED2指示芯片供电，也可不焊
- 防静电(可不加)

# Board PCB1
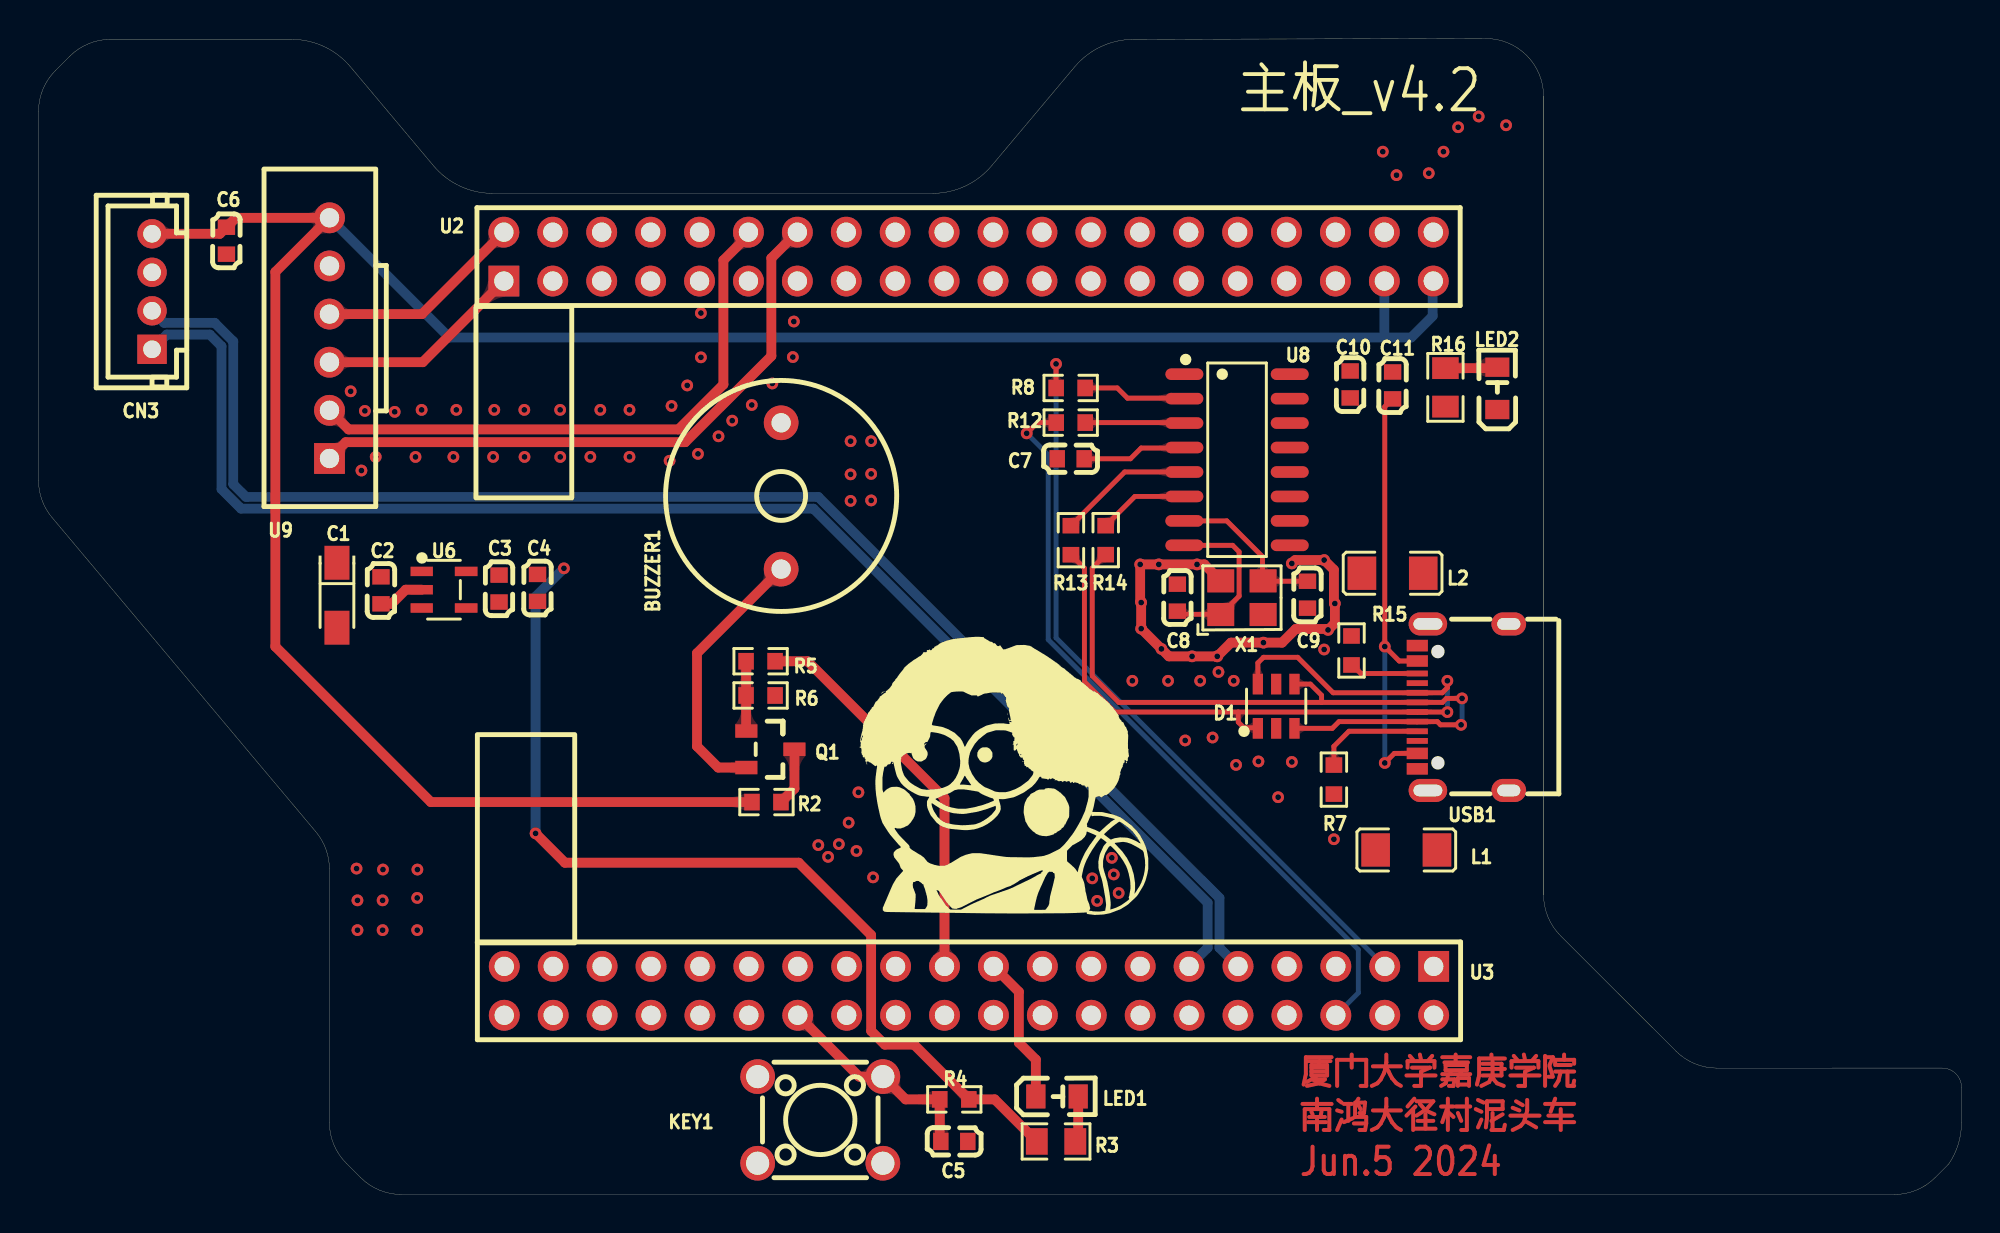
[diagram p4: board, top side]
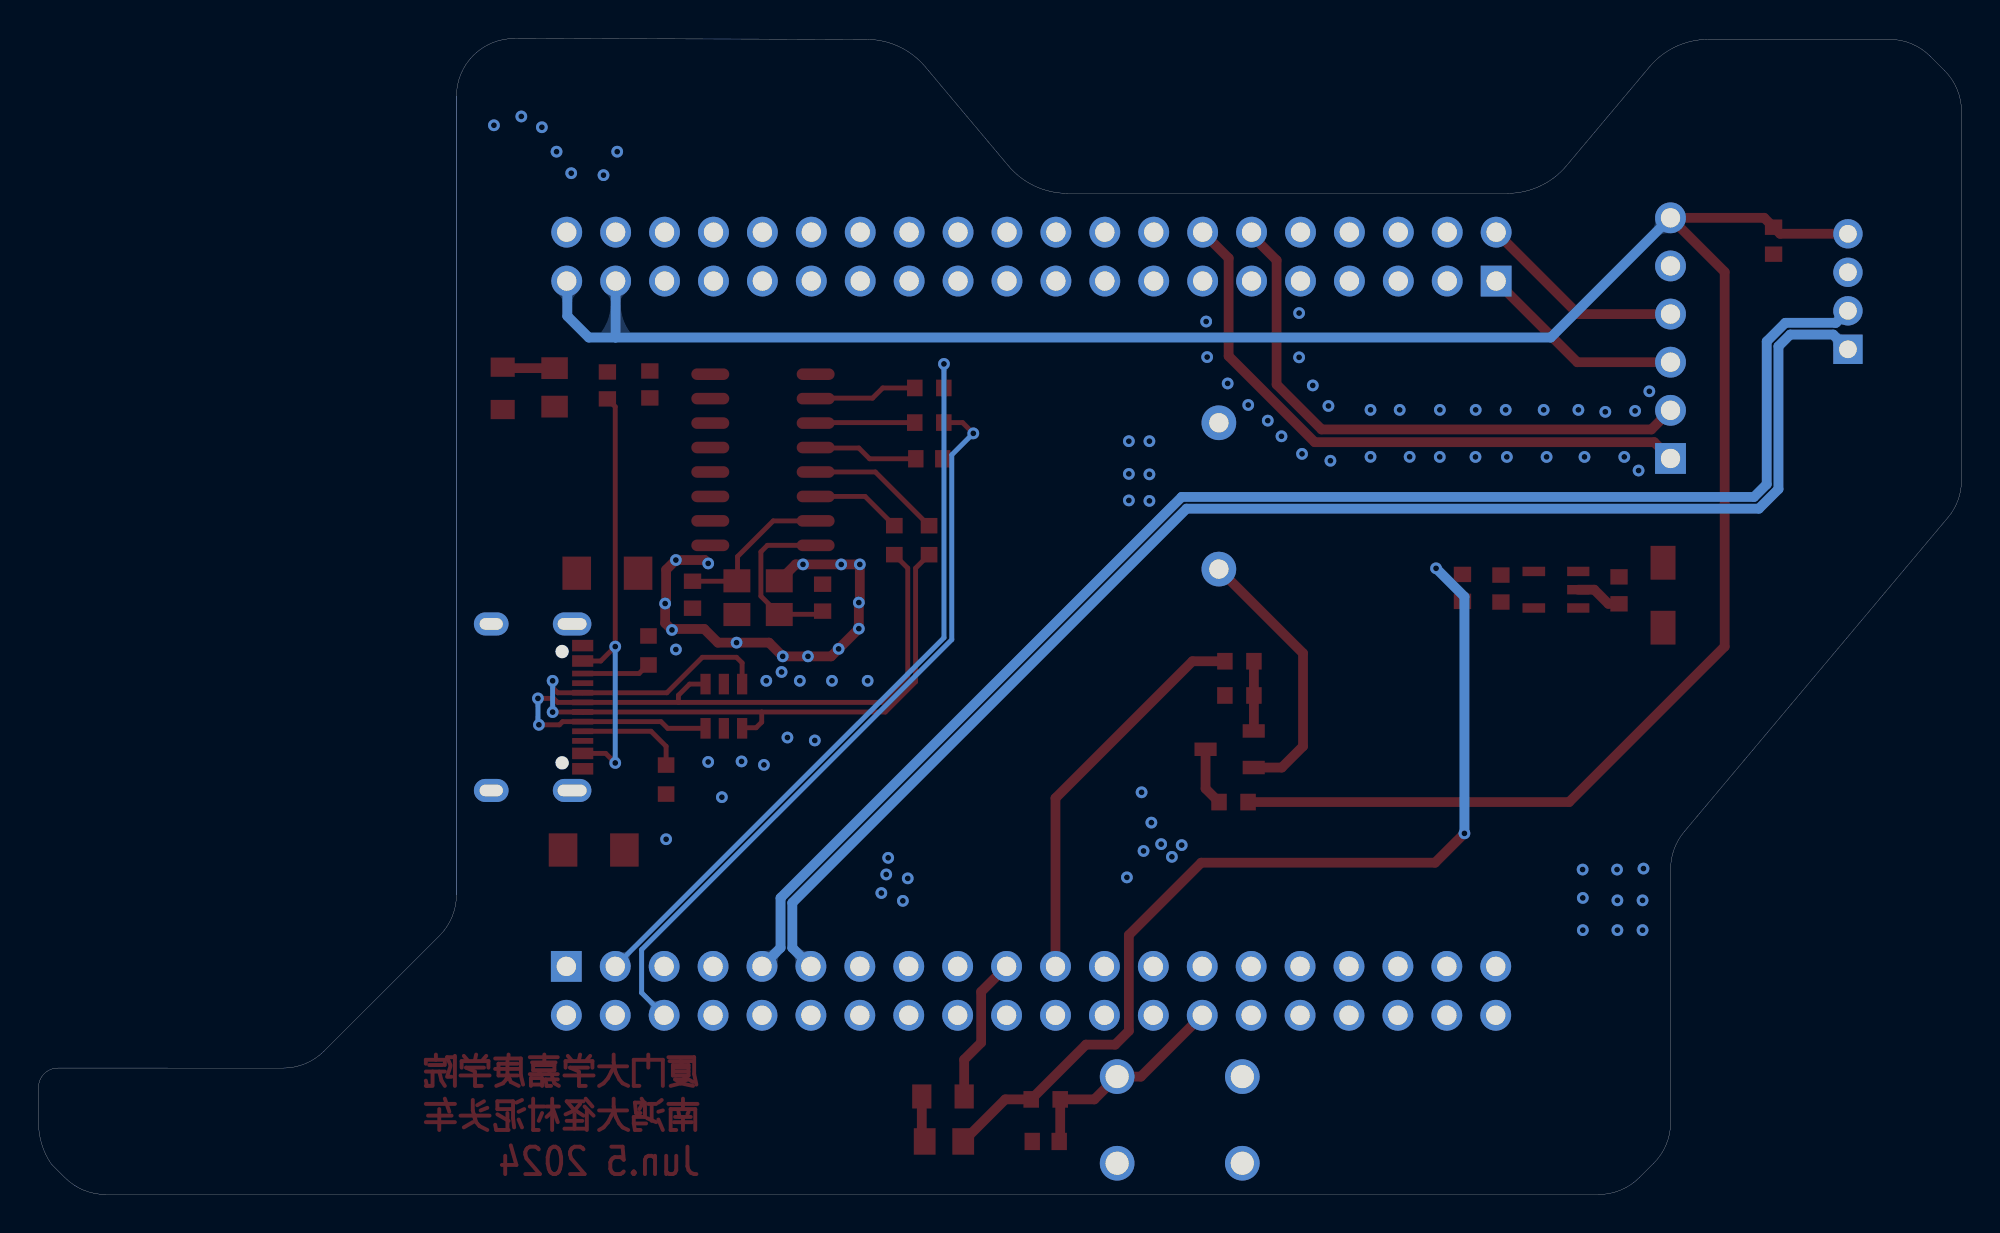
[diagram p5: board, bottom side, seen from below]

Outline 99.85 x 60.04 mm; copper layers: Top Layer, Bottom Layer. Coordinates in mm from the lower left corner of the outline.
Outline path: 78.15,57.04 arc(77.27,59.17) 75.14,60.04 56.87,60 arc(55.17,59.63) 53.8,58.57 49.49,53.43 arc(48.11,52.37) 46.42,52 23.58,52 arc(21.89,52.37) 20.51,53.43 16.2,58.57 arc(14.83,59.63) 13.14,60 3.74,60 arc(2.59,59.77) 1.62,59.12 0.88,58.38 arc(0.23,57.41) 0,56.26 0,37.09 arc(0.18,36.07) 0.7,35.16 14.4,18.84 arc(14.92,17.93) 15.1,16.91 15.1,3.74 arc(15.33,2.59) 15.98,1.62 16.73,0.88 arc(17.7,0.23) 18.85,0 96.36,0 arc(97.51,0.23) 98.48,0.88 99.19,1.58 arc(99.68,2.61) 99.85,3.74 99.85,5.57 arc(99.56,6.27) 98.85,6.57 87.15,6.57 arc(86,6.79) 85.03,7.44 79.03,13.44 arc(78.38,14.42) 78.15,15.56 ; 78.15,57.04 78.15,15.56 ; 78.15,57.04 78.15,15.56
Stack: Top Layer 0.035mm / Dielectric1 1.51mm FR4 er 4.5 / Bottom Layer 0.035mm

## Design rules (mm)
template: 自定义配置
spacing copperThickness1oz (default): track to track 0.102, other pairs 0.127 to 0.3
spacing copperThickness2oz: track to track 0.203, other pairs 0.152 to 0.3
track width copperThickness1oz (default): min 0.127, default 0.254, max 2.54
track width copperThickness2oz: min 0.203, default 0.254, max 2.54
differential pair differentialPair (default): width min 0.127, default 0.254, max 2.54; gap min 0.152, default 0.152
via viaSize (default): diameter min 0.5, default 0.61, max 10; hole min 0.3, default 0.305, max 6.299

## Placement (name value [footprint] x y rotation side)
BUZZER1  2.3kHz  [BUZ-TH_BD12.0-P7.60-D0.6-FD]  38.56 36.28 90 top
C1  10uF  [CAP-SMD_L3.2-W1.6-RD-C7171]  15.5 31.13 270 top
C2  1uF  [C0603]  17.78 31.38 90 top
C3  1uF  [C0603]  23.91 31.47 90 top
C4  100nF  [C0603]  25.91 31.51 90 top
C5  100nF  [C0603]  47.55 2.76 0 top
C6  1uF  [C0603]  9.76 49.54 90 top
C7  100nF  [C0603]  53.6 38.21 0 top
C8  20pF  [C0603]  59.13 31 270 top
C9  20pF  [C0603]  65.89 31.15 90 top
C10  100nF  [C0603]  68.11 42.07 90 top
C11  100nF  [C0603]  70.31 42.02 90 top
CN3  HDGC2001WV-4P  [CONN-TH_4P-P2.00_HDGC_HDGC2001WV-4P]  5.9 46.9 90 top
D1  USBLC6-2SC6  [SOT-23-6_L2.9-W1.6-P0.95-LS2.8-BL]  64.27 25.36 0 top
KEY1  TS665CJ  [SW-TH_4P-L6.0-W6.0-P4.50-LS6.5]  40.59 3.87 0 top
L1  CBG321609U000T  [L1206]  71.02 17.89 180 top
L2  CBG321609U000T  [L1206]  70.31 32.27 180 top
LED1  NCD0805R1  [LED0805-RD]  52.89 5.09 0 top
LED2  NCD0805R1  [LED0805-RD]  75.75 41.87 90 top
Q1  KTC9013S-H-RTK/P  [SOT-23-3_L2.9-W1.3-P1.90-LS2.4-TR-CW]  38 23.13 180 top
R2  100Ω  [R0603]  37.8 20.38 180 top
R3  4.7kΩ  [R0805]  52.83 2.76 180 top
R4  10kΩ  [R0603]  47.55 4.94 0 top
R5  1kΩ  [R0603]  37.49 27.7 180 top
R6  10kΩ  [R0603]  37.49 25.92 180 top
R7  5.1kΩ  [R0603]  67.26 21.55 270 top
R8  10Ω  [R0603]  53.6 41.89 0 top
R12  10Ω  [R0603]  53.6 40.09 0 top
R13  10Ω  [R0603]  53.61 33.98 90 top
R14  10Ω  [R0603]  55.41 33.99 90 top
R15  5.1kΩ  [R0603]  68.18 28.26 90 top
R16  4.7kΩ  [R0805]  73.05 41.92 90 top
U2  PM254-2-20-Z-8.5  [HDR-TH_40P-P2.54-V-F-R2-C20-S2.54]  48.29 48.71 0 top
U3  PM254-2-20-Z-8.5  [HDR-TH_40P-P2.54-V-F-R2-C20-S2.54]  48.31 10.58 180 top
U6  RT9013-33GB  [SOT-23-5_L3.0-W1.7-P0.95-LS2.8-BL]  21.05 31.41 270 top
U8  CH340G  [SOIC-16_L9.9-W3.9-P1.27-LS6.0-BL]  62.23 38.16 270 top
U9  ZX-HA2.54-6PZZ  [CONN-TH_6P-P2.50_ZX-HA2.54-6PZZ]  15.11 44.48 90 top
USB1  TYPE-C 16PIN 2MD(073)  [USB-C-SMD_TYPE-C-6PIN-2MD-073]  73.97 25.31 90 top
X1  12MHz  [OSC-SMD_4P-L3.2-W2.5-BL]  62.49 31 0 top

## Footprints (pads in the part's own frame, mm; a bottom-side part is the same pattern mirrored in y, then rotated)
BUZ-TH_BD12.0-P7.60-D0.6-FD
  round 1.8 hole 1: 1(-3.8,0) 2(3.8,0)
C0603
  rect 0.8x0.9 smd: 1(-0.7,0) 2(0.7,0)
CAP-SMD_L3.2-W1.6-RD-C7171
  rect 1.758x1.296 smd: 1(-1.687,0) 2(1.687,0)
CONN-TH_4P-P2.00_HDGC_HDGC2001WV-4P
  rect 1.524x1.524 hole 0.914: 1(-3,0)
  round 1.524 hole 0.914: 2(-1,0) 3(1,0) 4(3,0)
CONN-TH_6P-P2.50_ZX-HA2.54-6PZZ
  rect 1.6x1.6 hole 1: 1(-6.25,0)
  round 1.6 hole 1: 2(-3.75,0) 3(-1.25,0) 4(1.25,0) 5(3.75,0) 6(6.25,0)
HDR-TH_40P-P2.54-V-F-R2-C20-S2.54
  rect 1.6x1.6 hole 1: 1(-24.13,-1.27)
  round 1.6 hole 1: 2(-24.13,1.27) 3(-21.59,-1.27) 4(-21.59,1.27) 5(-19.05,-1.27) 6(-19.05,1.27) 7(-16.51,-1.27) 8(-16.51,1.27) 9(-13.97,-1.27) 10(-13.97,1.27) 11(-11.43,-1.27) 12(-11.43,1.27) 13(-8.89,-1.27) 14(-8.89,1.27) 15(-6.35,-1.27) 16(-6.35,1.27) 17(-3.81,-1.27) 18(-3.81,1.27) 19(-1.27,-1.27) 20(-1.27,1.27) 21(1.27,-1.27) 22(1.27,1.27) 23(3.81,-1.27) 24(3.81,1.27) 25(6.35,-1.27) 26(6.35,1.27) 27(8.89,-1.27) 28(8.89,1.27) 29(11.43,-1.27) 30(11.43,1.27) 31(13.97,-1.27) 32(13.97,1.27) 33(16.51,-1.27) 34(16.51,1.27) 35(19.05,-1.27) 36(19.05,1.27) 37(21.59,-1.27) 38(21.59,1.27) 39(24.13,-1.27) 40(24.13,1.27)
L1206
  rect 1.485x1.728 smd: 1(-1.593,0) 2(1.593,0)
LED0805-RD
  rect 1x1.25 smd: 1(-1.1,0) 2(1.1,0)
OSC-SMD_4P-L3.2-W2.5-BL
  rect 1.4x1.2 smd: 1(-1.1,-0.875) 2(1.1,-0.875) 3(1.1,0.875) 4(-1.1,0.875)
R0603
  rect 0.806x0.864 smd: 1(-0.753,0) 2(0.753,0)
R0805
  rect 1.133x1.377 smd: 1(-1,0) 2(1,0)
SOIC-16_L9.9-W3.9-P1.27-LS6.0-BL
  oval 0.602x1.971 smd: 1(-4.445,-2.736) 2(-3.175,-2.736) 3(-1.905,-2.736) 4(-0.635,-2.736) 5(0.635,-2.736) 6(1.905,-2.736) 7(3.175,-2.736) 8(4.445,-2.736) 9(4.445,2.736) 10(3.175,2.736) 11(1.905,2.736) 12(0.635,2.736) 13(-0.635,2.736) 14(-1.905,2.736) 15(-3.175,2.736) 16(-4.445,2.736)
SOT-23-3_L2.9-W1.3-P1.90-LS2.4-TR-CW
  rect 1.15x0.7 smd: 1(1.25,0.95) 2(1.25,-0.95) 3(-1.25,0)
SOT-23-5_L3.0-W1.7-P0.95-LS2.8-BL
  rect 0.49x1.157 smd: 1(-0.95,-1.153) 2(0,-1.153) 3(0.95,-1.153)
  rect 0.49x1.175 smd: 4(0.95,1.153) 5(-0.95,1.153)
SOT-23-6_L2.9-W1.6-P0.95-LS2.8-BL
  rect 0.532x1.072 smd: 1(-0.95,-1.149) 2(0,-1.149) 3(0.95,-1.149) 4(0.95,1.149) 5(0,1.149) 6(-0.95,1.149)
SW-TH_4P-L6.0-W6.0-P4.50-LS6.5
  round 1.8 hole 1.2: 1(-3.25,2.25) 2(3.25,2.25) 3(-3.25,-2.25) 4(3.25,-2.25)
USB-C-SMD_TYPE-C-6PIN-2MD-073
  rect 0.6x1.1 smd: 1(-3.2,2.375) 2(-2.4,2.375) 11(2.4,2.375) 12(3.2,2.375)
  rect 0.3x1.1 smd: 3(-1.75,2.375) 4(-1.25,2.375) 5(-0.75,2.375) 6(-0.25,2.375) 7(0.25,2.375) 8(0.75,2.375) 9(1.25,2.375) 10(1.75,2.375)
  oval 1.2x2 hole 0.6x1.5: 13(-4.325,1.825) 14(4.325,1.825)
  oval 1.2x1.8 hole 0.6x1.2: 13(-4.325,-2.375) 14(4.325,-2.375)

## Nets
As in the schematic.

Pads without a net: D1 5; KEY1 1 3; U2 3 4 5 6 7 8 9 10 11 13 15 16 17 18 19 20 21 22 23 24 25 26 27 28 29 30 31 32 33 34 35 36; U3 1 2 4 5 7 8 10 12 13 14 15 16 17 18 20 22 23 24 25 26 27 29 30 31 32 33 34 35 36 37 38 39 40; U6 4; U8 9 10 11 12 13 14 15; USB1 3 9

## Via types
v1: diameter 0.61, hole 0.305, Top Layer to Bottom Layer, 101 vias

## Routing (per net, layer and track width the routed paths; a pad name or vN(x,y) marks a point on that pad's centre or on a via; arc(x,y) is an arc through that point)
3V3: length 49.9
  Top Layer w0.508: v1(25.81,18.76) 27.33,17.23 39.48,17.23 43.23,13.47 43.23,8.5 43.95,7.78 45.46,7.78 R4.2 49.65,4.94 R3.2
  Bottom Layer w0.508: v1(27.28,32.52) 25.81,31.05 v1(25.81,18.76)
+5V: length 126.2
  Top Layer w0.508: CN3.4 9.42,49.9 C6.2 10.25,50.73 U9.6 12.3,47.92 12.3,28.46 20.37,20.38 R2.2
  Bottom Layer w0.508: 69.88,44.51 71.28,44.51 72.39,45.63 72.39,47.41 U2.39 ; 69.88,44.51 21.33,44.51 U9.6 ; 69.88,44.51 U2.37
GND: length 27
  Top Layer w0.508: U6.2 19.07,31.41 18.33,30.68 C2.1 ; v1(65.08,32.78) 65.25,32.95 v1(66.75,32.95) 67.26,32.45 67.26,30.75 v1(67.31,30.7) 67.31,29.68 v1(66.96,29.32) 66.91,29.37 65.28,29.37 64.57,28.66 v1(63.61,28.66) 61.92,28.66 v1(61.21,27.95) v1(59.9,27.95) 58.69,27.95 v1(58.31,28.34) v1(57.26,29.39) v1(57.26,30.75) 57.2,30.8 v1(57.2,32.73) v1(58.17,32.73) v1(60.15,32.73) 60.54,32.73 X1.4
  vias: v1(16.21,41.72) v1(16.51,16.93) v1(16.56,15.28) v1(16.56,13.73) v1(16.77,37.6) v1(16.95,40.7) v1(17.51,38.31) v1(17.89,16.88) v1(17.87,15.28) v1(17.87,13.73) v1(18.49,40.65) v1(19.58,38.31) v1(19.67,16.88) v1(19.66,15.4) v1(19.66,13.73) v1(19.89,40.75) v1(21.54,38.31) v1(21.69,40.75) v1(23.61,38.31) v1(23.67,40.75) v1(25.22,40.75) v1(25.24,38.31) v1(27.08,40.75) v1(27.09,38.31) v1(28.65,38.32) v1(29.17,40.75) v1(30.69,40.75) v1(30.69,38.32) v1(32.77,38.11) v1(32.87,40.96) v1(33.68,42.02) v1(34.24,38.47) v1(34.39,45.78) v1(34.39,43.48) v1(35.31,39.38) v1(36.02,40.2) v1(37.04,41.01) v1(38.1,42.13) v1(39.22,45.34) v1(39.17,43.5) v1(40.49,18.15) v1(41,17.54) v1(41.56,18.2) v1(42.07,19.32) v1(42.17,39.13) v1(42.17,37.41) v1(42.17,36.03) v1(42.47,17.84) v1(42.57,20.89) v1(43.23,39.13) v1(43.23,37.43) v1(43.23,36.05) v1(43.34,16.47) v1(54.71,16.42) v1(54.97,15.25) v1(55.73,17.49) v1(55.83,16.62) v1(56.09,15.66) v1(56.8,26.68) v1(58.65,26.68) v1(59.54,23.58) v1(60.32,26.68) v1(60.96,23.74) v1(61.27,27.14) v1(62.06,26.68) v1(62.18,22.31) v1(63.35,22.5) v1(64.37,20.64) v1(65.08,22.47) v1(66.75,28.31) v1(67.26,18.45) v1(69.8,54.17) v1(70.51,52.95) v1(72.19,53.05) v1(72.95,54.17) v1(73.71,55.44) v1(74.78,55.99) v1(76.2,55.54)
VBUS: length 23
  Top Layer w0.254: v1(69.9,22.42) 70.4,22.91 USB1.2 ; C11.1 69.9,40.92 v1(69.9,28.46) 70.65,27.71 USB1.11
  Bottom Layer w0.254: v1(69.9,22.42) v1(69.9,28.46)
BUZZER: length 20.5
  Top Layer w0.508: R5.1 39.93,27.7 47.04,20.59 U3.21
D+: length 42
  Top Layer w0.254: v1(73.15,25.06) 73.15,25.06 USB1.6 62.3,25.06 ; 62.3,25.06 55.88,25.06 54.31,26.63 54.31,32.53 R13.1 ; 62.3,25.06 62.3,24.53 62.59,24.24 63.28,24.24 D1.1 ; v1(73.15,26.68) 73.15,26.32 72.89,26.06 USB1.8 67.22,26.06 65.38,27.9 63.61,27.9 63.32,27.61 D1.6
  Bottom Layer w0.254: v1(73.15,26.68) v1(73.15,25.06)
D-: length 38.7
  Top Layer w0.254: 66.62,25.56 USB1.7 72.9,25.56 73.1,25.77 v1(73.92,25.77) ; 66.62,25.56 56.09,25.56 54.71,26.94 54.71,32.54 R14.1 ; 66.62,25.56 66.62,25.93 66.04,26.51 D1.4 ; D1.3 67.18,24.21 67.53,24.56 USB1.5 72.64,24.56 72.8,24.4 v1(73.87,24.4)
  Bottom Layer w0.254: v1(73.92,25.77) 73.92,24.45 v1(73.87,24.4)
MCU_ENCODER_A: length 76.4
  Bottom Layer w0.508: U3.9 61.32,12.81 61.32,15.4 40.49,36.23 10.77,36.23 10.11,36.89 10.11,44.31 9.15,45.28 6.52,45.28 CN3.2
MCU_ENCODER_B: length 75.4
  Bottom Layer w0.508: U3.11 60.71,12.81 60.71,15.15 40.24,35.62 10.52,35.62 9.5,36.64 9.5,44.06 8.89,44.67 6.66,44.67 CN3.1
MCU_KEY: length 11.4
  Top Layer w0.508: U3.28 42.61,6.12 KEY1.2 45.03,4.94 R4.1 46.8,2.81 C5.1
MCU_MOTOR_DIR: length 10.8
  Top Layer w0.508: U9.4 19.91,45.73 U2.2
MCU_MOTOR_PWM: length 10.8
  Top Layer w0.508: U9.3 19.95,43.23 U2.1
MCU_SERVO_A: length 30.3
  Top Layer w0.508: U9.2 16.1,39.74 33.23,39.74 35.56,42.07 35.56,48.53 36.86,49.83 U2.12
MCU_SERVO_B: length 32.1
  Top Layer w0.508: U9.1 15.96,39.08 33.58,39.08 38.05,43.55 38.05,48.63 39.4,49.98
MCU_SYSTEM_LED: length 7.7
  Top Layer w0.508: 51.79,5.09 51.79,7.01 50.9,7.89 50.9,10.53 U3.19
USB_UART_RX: length 39.6
  Top Layer w0.254: R8.1 52.83,41.9 v1(52.83,43.14)
  Bottom Layer w0.254: U3.3 52.83,28.92 v1(52.83,43.14)
USB_UART_TX: length 39.6
  Top Layer w0.254: R12.1 51.87,40.09 v1(51.31,39.53)
  Bottom Layer w0.254: U3.6 68.53,10.48 68.53,12.72 52.43,28.82 52.43,38.42 v1(51.31,39.53)
$3N545: length 3.6
  Top Layer w0.508: R5.2 R6.2 36.74,24.09 Q1.2
$3N546: length 14
  Top Layer w0.508: Q1.1 35.29,22.18 34.19,23.28 34.19,28.11 BUZZER1.1
$3N549: length 3
  Top Layer w0.508: R2.1 39.25,21.08 Q1.3
$3N998: length 2.4
  Top Layer w0.508: 53.99,5.09 53.99,2.91 R3.1
$4N891: length 9
  Top Layer w0.254: C8.2 59.3,30.14 61.38,30.14 X1.1 62.34,31.08 62.34,33.38 62,33.72 U8.8
$4N894: length 5.4
  Top Layer w0.254: U8.2 59.47,41.36 56.54,41.36 56.02,41.89 R8.2
$4N895: length 5.2
  Top Layer w0.254: R12.2 59.47,40.09 U8.3
$4N896: length 7
  Top Layer w0.254: U8.5 56.4,37.53 R13.2
$4N897: length 4.7
  Top Layer w0.254: 55.41,34.74 56.93,36.26 U8.6
$4N898: length 8.4
  Top Layer w0.254: U8.7 61.7,34.99 63.55,33.13 63.55,31.91 X1.3 63.61,31.85 C9.2
$4N903: length 5.4
  Top Layer w0.254: U8.4 59.47,38.77 57.26,38.77 56.7,38.21 C7.2
$4N910: length 5.6
  Top Layer w0.254: USB1.4 68.04,24.06 67.26,23.28 R7.1
$4N911: length 3.6
  Top Layer w0.254: USB1.10 68.67,27.06 68.22,27.5
$4N1948: length 2.7
  Top Layer w0.508: LED2.2 75.7,42.92 R16.2

## Copper pours and planes (outline as drawn; the poured copper is in the pictures)
3V3 on Top Layer: 21.39,33.59 27.79,33.59 27.79,31.47 21.39,31.47
+5V on Top Layer: 12.04,34.3 12.04,31.46 18.75,31.46 19.1,31.81 20.58,31.81 20.58,31.05 18.75,31.05 18.75,29.43 20.68,29.43 21.19,29.93 21.19,32.93 20.63,33.49 17.28,33.49 16.46,34.3
+5V on Bottom Layer: 68.4,48.71 74.37,48.71 74.37,44.21 68.4,44.21
GND on Top Layer: -1.22,60.72 78.23,60.72 80.17,58.79 80.17,36.69 79.2,35.72 70.21,35.72 70.21,29.53 70.26,29.48 70.26,17.69 74.93,13.02 74.93,8.34 81.64,8.34 82.55,7.43 82.55,-0.85 -0.5,-0.75 -1.32,0.06 -1.32,60.62
GND on Bottom Layer: -1.93,60.77 78.13,60.77 78.13,35.83 70.31,35.83 70.21,35.72 70.21,17.03 74.88,12.36 74.88,8.63 74.93,8.58 74.93,8.34 81.59,8.34 81.64,8.29 81.64,0.42 80.47,-0.75 -4.92,-1.66
PGND on Top Layer: 70.01,35.88 79.4,35.88 80.83,34.45 80.83,28.05 101.81,7.07 101.81,-3.65 102.01,-3.85 85.3,-3.85 82.71,-1.26 82.71,7.38 80.67,8.45 74.93,8.45 70.4,18.39
PGND on Bottom Layer: 70.41,35.57 70.51,35.47 78.9,35.47 78.9,14.99 86.36,7.53 104.45,7.53 104.65,7.73 105.06,7.33 105.06,-2.12 81.94,-2.12 81.89,-2.07 81.89,8.6 81.84,8.65 75.39,8.65 74.98,9.05 74.98,12.41 70.31,17.08 70.31,35.47
VBUS on Top Layer: 62.94,41.41 66.14,41.41 67.36,40.2 71.33,40.2 71.33,39.28 74.58,39.28 74.58,41.92 67.72,41.92 66.09,43.55 62.94,43.55

Small or netless copper shapes (teardrops, artwork), in the pictures only: 83 on Top Layer, 18 on Bottom Layer

## Text on the board
Top Layer: 厦门大学嘉庚学院 / 南鸿大径村泥头车 / Jun.5 2024
Top Silkscreen Layer: 主板_v4.2
